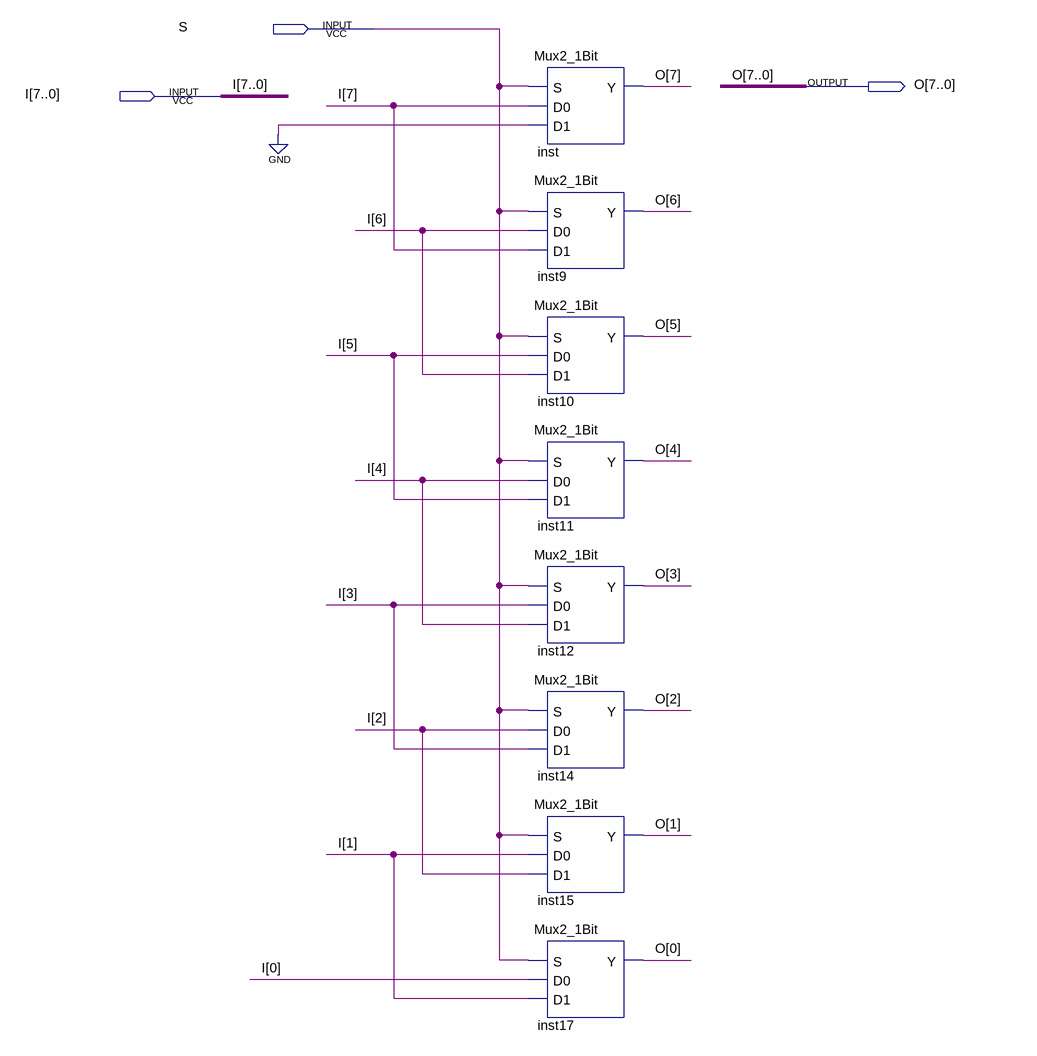
[diagram p0: schematic sheet]
// Quartus schematic ShiftRight1.bdf as structural Verilog: 8 symbols, 3 pins
module ShiftRight1 (
  input  S,
  input  [7:0] I,
  output [7:0] O
);

  Mux2_1Bit inst (.S(S), .D0(I[7]), .D1(1'b0), .Y(O[7]));
  Mux2_1Bit inst9 (.S(S), .D0(I[6]), .D1(I[7]), .Y(O[6]));
  Mux2_1Bit inst10 (.S(S), .D0(I[5]), .D1(I[6]), .Y(O[5]));
  Mux2_1Bit inst11 (.S(S), .D0(I[4]), .D1(I[5]), .Y(O[4]));
  Mux2_1Bit inst12 (.S(S), .D0(I[3]), .D1(I[4]), .Y(O[3]));
  Mux2_1Bit inst14 (.S(S), .D0(I[2]), .D1(I[3]), .Y(O[2]));
  Mux2_1Bit inst15 (.S(S), .D0(I[1]), .D1(I[2]), .Y(O[1]));
  Mux2_1Bit inst17 (.S(S), .D0(I[0]), .D1(I[1]), .Y(O[0]));
endmodule
